# Altium schematic sheet switch.SchDoc: switch
size A4; Organization: Altium Limited; Address1: L3, 12a Rodborough Rd; Address2: Frenchs Forest; Address3: NSW; Address4: Australia 2086
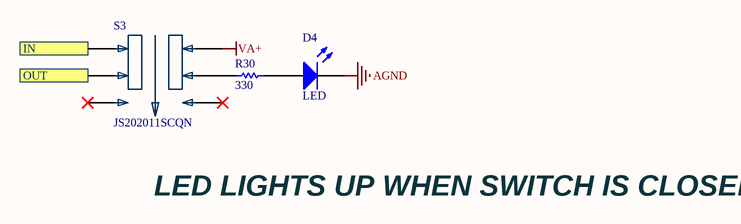
[diagram p0: switch.SchDoc]

## Parts
D4  LED  [STD_LED]
R30  330  [STD_0805_R]
S3  JS202011SCQN  [SW_JS202011SCQN]

## Ports
IN (in), OUT (out)

## Nets
AGND: D4.2
VA+: S3.4
IN: S3.1 ; port IN
OUT: S3.2 ; port OUT
NetD4_1: D4.1 R30.2
NetR30_1: R30.1 S3.5

Not connected (* = marked no-connect by the designer): S3 3* 6*

## Notes on the sheet
- LED LIGHTS UP WHEN SWITCH IS CLOSED
- Title
- Date:
- RE:
- Arturo di Girolamo
- Size:
- A3
- A

## Library data of the parts
D4 = LNJ037X8ARA: Typical LED; MFGPN: LNJ037X8ARA
R30 = RL1220S-R33-F: 330 1% 1/3W; Value: 1K; MFGPN: RL1220S-R33-F
S3 = JS202011SCQN: Slide Switch DPDT Surface Mount; MF: C&K; MFGPN: JS202011SCQN; Value: *; Package: None; SnapEDA_Link: https://www.snapeda.com/parts/JS202011SCQN/C%26K/view-part/592122/?ref=snap; Digi-Key_Part_Number: 401-2002-1-ND; Digi-Key_Purchase_URL: https://www.digikey.com/product-detail/en/c-k/JS202011SCQN/401-2002-1-ND/1640098?utm_source=snapeda&utm_medium=aggregator&utm_campaign=symbol